# EAGLE schematic resistor-rc-filters (EAGLE 9.5.2)
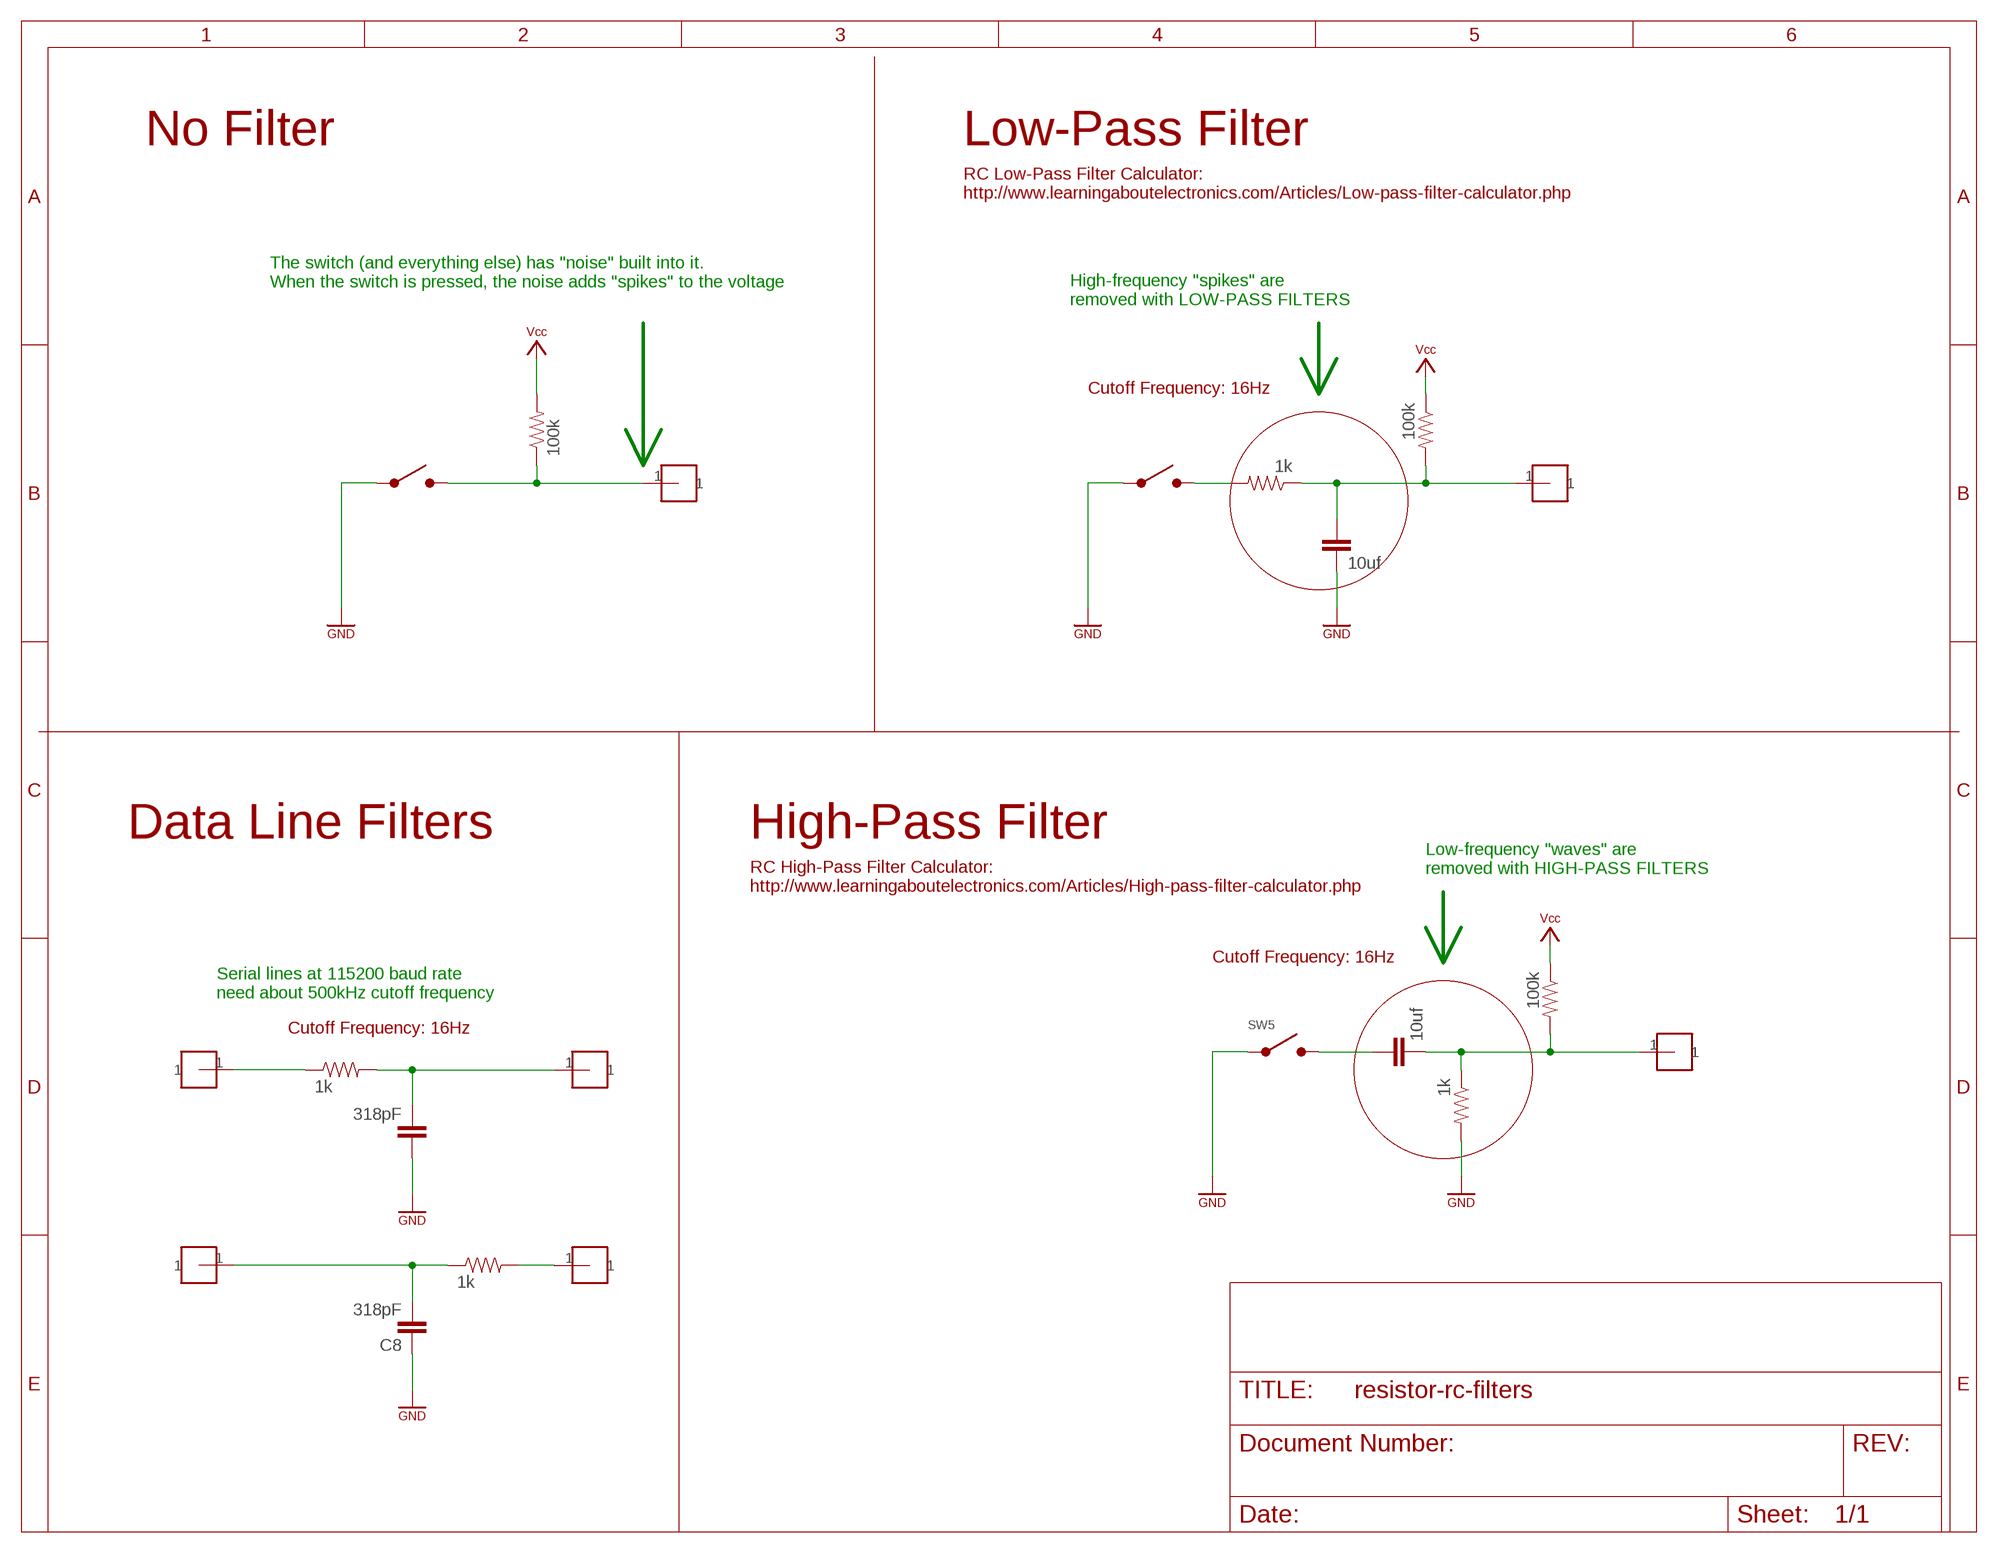
[diagram p0: schematic, sheet 1]

## Parts
C5  10uf  COMPONENT_CAP-0805  [0805]
C6  10uf  COMPONENT_CAP-0805  [0805]
C7  318pF  COMPONENT_CAP-0805  [0805]
C8  318pF  COMPONENT_CAP-0805  [0805]
R8  100k  COMPONENT_RESISTOR-0805  [0805]
R9  1k  COMPONENT_RESISTOR-0805  [0805]
R10  100k  COMPONENT_RESISTOR-0805  [0805]
R11  100k  COMPONENT_RESISTOR-0805  [0805]
R12  1k  COMPONENT_RESISTOR-0805  [0805]
R13  1k  COMPONENT_RESISTOR-0805  [0805]
R14  1k  COMPONENT_RESISTOR-0805  [0805]
SW4  SWITCH_BUTTON_SPST  [7914G-1-000E]
SW5  SWITCH_BUTTON_SPST  [7914G-1-000E]
SW6  SWITCH_BUTTON_SPST  [7914G-1-000E]
U$1  HEADER-1-TESTPOINT  [TESTPOINT-1]
U$2  HEADER-1-TESTPOINT  [TESTPOINT-1]
U$3  HEADER-1-TESTPOINT  [TESTPOINT-1]
U$4  HEADER-1-TESTPOINT  [TESTPOINT-1]
U$5  HEADER-1-TESTPOINT  [TESTPOINT-1]
U$6  HEADER-1-TESTPOINT  [TESTPOINT-1]
U$7  HEADER-1-TESTPOINT  [TESTPOINT-1]

## Nets
GND: C5.2 C7.1 C8.1 R12.2 SW4.1A SW4.1B SW5.1A SW5.1B SW6.1A SW6.1B ; supply symbol labelled SYMBOL_GND
N$1: R8.1 SW4.2A SW4.2B U$5.1
N$3: C5.1 R9.1 R10.2 U$6.1
N$4: R9.2 SW6.2A SW6.2B
N$6: C7.2 R14.2 U$2.1
N$7: R14.1 U$3.1
N$8: C8.2 R13.1 U$4.1
N$9: R13.2 U$1.1
N$10: C6.2 R11.2 R12.1 U$7.1
N$11: C6.1 SW5.2A SW5.2B
VCC: R8.2 R10.1 R11.1 ; supply symbol labelled SYMBOL_VCC

## Notes on the sheet
- No Filter | Low-Pass Filter
- RC Low-Pass Filter Calculator:
  http://www.learningaboutelectronics.com/Articles/Low-pass-filter-calculator.php
- The switch (and everything else) has "noise" built into it.
  When the switch is pressed, the noise adds "spikes" to the voltage
- High-frequency "spikes" are
  removed with LOW-PASS FILTERS
- Cutoff Frequency: 16Hz
- Data Line Filters | High-Pass Filter
- Low-frequency "waves" are
  removed with HIGH-PASS FILTERS
- RC High-Pass Filter Calculator:
  http://www.learningaboutelectronics.com/Articles/High-pass-filter-calculator.php
- Cutoff Frequency: 16Hz
- Serial lines at 115200 baud rate
  need about 500kHz cutoff frequency
- Cutoff Frequency: 16Hz

## Library data of the parts
C5-C8 = homemade-hardware:COMPONENT_CAP: Capacitor Standard 0603 ceramic capacitor, and 0.1" leaded capacitor.
R8-R14 = homemade-hardware:COMPONENT_RESISTOR
SW4-SW6 = homemade-hardware:SWITCH_BUTTON_SPST: 7914G-1-000E <https://www.digikey.com/product-detail/en/bourns-inc/7914G-1-000E/7914G-000EDKR-ND/741386>: Momentary Button; HEIGHT: 4.2; PN: 7914G-1-000E
U$1-U$7 = homemade-hardware:HEADER-1: M20-8890845 <https://www.digikey.com/products/en?keywords=952-3236-ND>: Horizontal Male SMD Headers M20-7910842R <https://www.digikey.com/product-detail/en/harwin-inc/M20-7910842R/952-3200-6-ND/6559341>: Horizontal Female SMD Headers